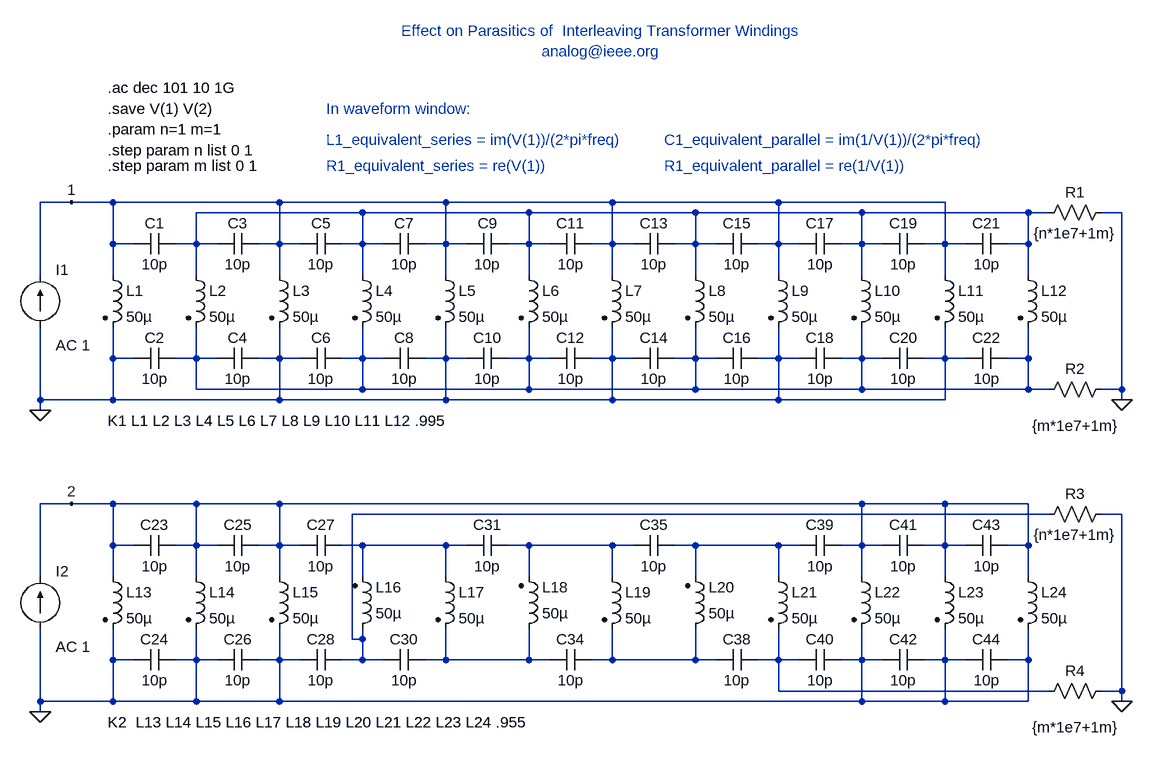
[diagram p0: schematic Transformer_1.asc]
Transformer_1.asc, the LTspice schematic file:
Version 4
SHEET 1 2480 976
WIRE 384 256 384 208
WIRE 384 208 416 208
WIRE 480 208 512 208
WIRE 512 256 512 208
WIRE 512 208 544 208
WIRE 384 336 384 384
WIRE 384 384 416 384
WIRE 480 384 512 384
WIRE 512 336 512 384
WIRE 512 384 544 384
WIRE 608 208 640 208
WIRE 640 208 640 256
WIRE 608 384 640 384
WIRE 640 384 640 336
WIRE 640 208 672 208
WIRE 736 208 768 208
WIRE 864 208 896 208
WIRE 992 208 1024 208
WIRE 1024 208 1024 256
WIRE 640 384 672 384
WIRE 736 384 768 384
WIRE 864 384 896 384
WIRE 992 384 1024 384
WIRE 1024 384 1024 336
WIRE 896 208 896 256
WIRE 896 336 896 384
WIRE 896 208 928 208
WIRE 896 384 928 384
WIRE 768 208 768 256
WIRE 768 336 768 384
WIRE 768 208 800 208
WIRE 768 384 800 384
WIRE 272 256 272 144
WIRE 272 336 272 448
WIRE 272 144 320 144
WIRE 640 144 640 208
WIRE 384 208 384 144
WIRE 384 144 640 144
WIRE 640 144 896 144
WIRE 896 144 896 208
WIRE 272 448 384 448
WIRE 384 448 384 384
WIRE 384 448 640 448
WIRE 640 448 640 384
WIRE 640 448 896 448
WIRE 896 448 896 384
WIRE 272 464 272 448
WIRE 512 208 512 160
WIRE 512 160 768 160
WIRE 768 160 768 208
WIRE 768 160 1024 160
WIRE 1024 160 1024 208
WIRE 512 384 512 432
WIRE 512 432 768 432
WIRE 768 432 768 384
WIRE 768 432 1024 432
WIRE 1024 432 1024 384
WIRE 320 144 384 144
WIRE 1024 160 1280 160
WIRE 1936 160 1936 432
WIRE 1936 432 1904 432
WIRE 1904 160 1936 160
WIRE 1280 432 1024 432
WIRE 1936 448 1936 432
WIRE 1120 208 1152 208
WIRE 1248 208 1280 208
WIRE 1280 208 1280 256
WIRE 1120 384 1152 384
WIRE 1248 384 1280 384
WIRE 1280 384 1280 336
WIRE 1152 208 1152 256
WIRE 1152 336 1152 384
WIRE 1152 208 1184 208
WIRE 1152 384 1184 384
WIRE 1152 144 1152 208
WIRE 1152 448 1152 384
WIRE 1280 160 1280 208
WIRE 1280 432 1280 384
WIRE 1280 160 1536 160
WIRE 1536 432 1280 432
WIRE 1056 208 1024 208
WIRE 1056 384 1024 384
WIRE 896 448 1152 448
WIRE 896 144 1152 144
WIRE 272 720 272 608
WIRE 272 800 272 912
WIRE 272 608 320 608
WIRE 272 912 384 912
WIRE 272 928 272 912
WIRE 320 608 384 608
WIRE 1376 208 1408 208
WIRE 1504 208 1536 208
WIRE 1536 208 1536 256
WIRE 1376 384 1408 384
WIRE 1504 384 1536 384
WIRE 1536 384 1536 336
WIRE 1408 208 1408 256
WIRE 1408 336 1408 384
WIRE 1408 208 1440 208
WIRE 1408 384 1440 384
WIRE 1408 144 1408 208
WIRE 1408 448 1408 384
WIRE 1536 160 1536 208
WIRE 1536 432 1536 384
WIRE 1536 160 1792 160
WIRE 1792 432 1536 432
WIRE 1632 208 1664 208
WIRE 1760 208 1792 208
WIRE 1792 208 1792 256
WIRE 1632 384 1664 384
WIRE 1760 384 1792 384
WIRE 1792 384 1792 336
WIRE 1664 208 1664 256
WIRE 1664 336 1664 384
WIRE 1664 208 1696 208
WIRE 1664 384 1696 384
WIRE 1664 144 1664 208
WIRE 1664 448 1664 384
WIRE 1792 160 1792 208
WIRE 1792 432 1792 384
WIRE 1792 160 1824 160
WIRE 1824 432 1792 432
WIRE 1568 208 1536 208
WIRE 1568 384 1536 384
WIRE 1408 448 1664 448
WIRE 1408 144 1664 144
WIRE 384 720 384 672
WIRE 384 672 416 672
WIRE 480 672 512 672
WIRE 512 720 512 672
WIRE 512 672 544 672
WIRE 384 800 384 848
WIRE 384 848 416 848
WIRE 480 848 512 848
WIRE 512 800 512 848
WIRE 512 848 544 848
WIRE 608 672 640 672
WIRE 640 672 640 720
WIRE 608 848 640 848
WIRE 640 848 640 800
WIRE 640 672 672 672
WIRE 736 672 768 672
WIRE 768 672 896 672
WIRE 992 672 1024 672
WIRE 1024 672 1024 720
WIRE 640 848 672 848
WIRE 736 848 768 848
WIRE 864 848 896 848
WIRE 896 848 1024 848
WIRE 1024 848 1024 800
WIRE 896 672 896 720
WIRE 896 800 896 848
WIRE 896 672 928 672
WIRE 768 672 768 720
WIRE 768 800 768 816
WIRE 768 848 800 848
WIRE 640 608 640 672
WIRE 384 672 384 608
WIRE 384 608 512 608
WIRE 640 608 1536 608
WIRE 384 912 384 848
WIRE 384 912 512 912
WIRE 640 912 640 848
WIRE 512 672 512 608
WIRE 512 848 512 912
WIRE 1936 624 1936 896
WIRE 1936 896 1904 896
WIRE 1904 624 1936 624
WIRE 1936 912 1936 896
WIRE 1024 672 1152 672
WIRE 1248 672 1280 672
WIRE 1280 672 1280 720
WIRE 1120 848 1152 848
WIRE 1152 848 1280 848
WIRE 1280 848 1280 800
WIRE 1152 672 1152 720
WIRE 1152 800 1152 848
WIRE 1152 672 1184 672
WIRE 1056 848 1024 848
WIRE 640 912 1536 912
WIRE 1280 672 1408 672
WIRE 1504 672 1536 672
WIRE 1536 672 1536 720
WIRE 1376 848 1408 848
WIRE 1504 848 1536 848
WIRE 1536 848 1536 800
WIRE 1408 672 1408 720
WIRE 1408 800 1408 848
WIRE 1408 672 1440 672
WIRE 1408 848 1440 848
WIRE 1536 608 1536 672
WIRE 1632 672 1664 672
WIRE 1760 672 1792 672
WIRE 1792 672 1792 720
WIRE 1632 848 1664 848
WIRE 1760 848 1792 848
WIRE 1792 848 1792 800
WIRE 1664 672 1664 720
WIRE 1664 800 1664 848
WIRE 1664 672 1696 672
WIRE 1664 848 1696 848
WIRE 1664 608 1664 672
WIRE 1664 912 1664 848
WIRE 1568 672 1536 672
WIRE 1568 848 1536 848
WIRE 1152 448 1408 448
WIRE 1152 144 1408 144
WIRE 1312 848 1280 848
WIRE 1792 672 1792 608
WIRE 1792 608 1664 608
WIRE 1536 608 1664 608
WIRE 1792 848 1792 912
WIRE 1792 912 1664 912
WIRE 1536 848 1536 912
WIRE 1536 912 1664 912
WIRE 512 912 640 912
WIRE 512 608 640 608
WIRE 1824 896 1408 896
WIRE 1408 896 1408 848
WIRE 768 816 752 816
WIRE 768 816 768 848
WIRE 752 816 752 624
WIRE 752 624 1824 624
WIRE 1312 208 1280 208
WIRE 1312 384 1280 384
FLAG 272 464 0
FLAG 320 144 1
FLAG 1936 448 0
FLAG 272 928 0
FLAG 320 608 2
FLAG 1936 912 0
SYMBOL ind2 368 240 R0
SYMATTR InstName L1
SYMATTR Value 50µ
SYMATTR SpiceLine Rser=.5 Rpar=1e7 Cpar=1p
SYMBOL ind2 496 240 R0
SYMATTR InstName L2
SYMATTR Value 50µ
SYMATTR SpiceLine Rser=.5 Rpar=1e7 Cpar=1p
SYMBOL ind2 624 240 R0
SYMATTR InstName L3
SYMATTR Value 50µ
SYMATTR SpiceLine Rser=.5 Rpar=1e7 Cpar=1p
SYMBOL ind2 752 240 R0
SYMATTR InstName L4
SYMATTR Value 50µ
SYMATTR SpiceLine Rser=.5 Rpar=1e7 Cpar=1p
SYMBOL ind2 880 240 R0
SYMATTR InstName L5
SYMATTR Value 50µ
SYMATTR SpiceLine Rser=.5 Rpar=1e7 Cpar=1p
SYMBOL ind2 1008 240 R0
SYMATTR InstName L6
SYMATTR Value 50µ
SYMATTR SpiceLine Rser=.5 Rpar=1e7 Cpar=1p
SYMBOL cap 480 192 R90
WINDOW 0 0 32 VBottom 0
WINDOW 3 32 32 VTop 0
SYMATTR InstName C1
SYMATTR Value 10p
SYMBOL cap 480 368 R90
WINDOW 0 0 32 VBottom 0
WINDOW 3 32 32 VTop 0
SYMATTR InstName C2
SYMATTR Value 10p
SYMBOL cap 608 192 R90
WINDOW 0 0 32 VBottom 0
WINDOW 3 32 32 VTop 0
SYMATTR InstName C3
SYMATTR Value 10p
SYMBOL cap 608 368 R90
WINDOW 0 0 32 VBottom 0
WINDOW 3 32 32 VTop 0
SYMATTR InstName C4
SYMATTR Value 10p
SYMBOL cap 736 192 R90
WINDOW 0 0 32 VBottom 0
WINDOW 3 32 32 VTop 0
SYMATTR InstName C5
SYMATTR Value 10p
SYMBOL cap 736 368 R90
WINDOW 0 0 32 VBottom 0
WINDOW 3 32 32 VTop 0
SYMATTR InstName C6
SYMATTR Value 10p
SYMBOL cap 864 192 R90
WINDOW 0 0 32 VBottom 0
WINDOW 3 32 32 VTop 0
SYMATTR InstName C7
SYMATTR Value 10p
SYMBOL cap 864 368 R90
WINDOW 0 0 32 VBottom 0
WINDOW 3 32 32 VTop 0
SYMATTR InstName C8
SYMATTR Value 10p
SYMBOL cap 992 192 R90
WINDOW 0 0 32 VBottom 0
WINDOW 3 32 32 VTop 0
SYMATTR InstName C9
SYMATTR Value 10p
SYMBOL cap 992 368 R90
WINDOW 0 0 32 VBottom 0
WINDOW 3 32 32 VTop 0
SYMATTR InstName C10
SYMATTR Value 10p
SYMBOL current 272 336 M180
WINDOW 0 24 88 Left 0
WINDOW 3 24 0 Left 0
WINDOW 123 24 -28 Left 0
WINDOW 39 0 0 Left 0
SYMATTR InstName I1
SYMATTR Value ""
SYMATTR Value2 AC 1
SYMBOL res 1920 144 R90
WINDOW 0 0 56 VBottom 0
WINDOW 3 32 56 VTop 0
SYMATTR InstName R1
SYMATTR Value {n*1e7+1m}
SYMBOL res 1920 416 R90
WINDOW 0 0 56 VBottom 0
WINDOW 3 56 55 VTop 0
SYMATTR InstName R2
SYMATTR Value {m*1e7+1m}
SYMBOL ind2 1136 240 R0
SYMATTR InstName L7
SYMATTR Value 50µ
SYMATTR SpiceLine Rser=.5 Rpar=1e7 Cpar=1p
SYMBOL ind2 1264 240 R0
SYMATTR InstName L8
SYMATTR Value 50µ
SYMATTR SpiceLine Rser=.5 Rpar=1e7 Cpar=1p
SYMBOL cap 1120 192 R90
WINDOW 0 0 32 VBottom 0
WINDOW 3 32 32 VTop 0
SYMATTR InstName C11
SYMATTR Value 10p
SYMBOL cap 1120 368 R90
WINDOW 0 0 32 VBottom 0
WINDOW 3 32 32 VTop 0
SYMATTR InstName C12
SYMATTR Value 10p
SYMBOL cap 1248 192 R90
WINDOW 0 0 32 VBottom 0
WINDOW 3 32 32 VTop 0
SYMATTR InstName C13
SYMATTR Value 10p
SYMBOL cap 1248 368 R90
WINDOW 0 0 32 VBottom 0
WINDOW 3 32 32 VTop 0
SYMATTR InstName C14
SYMATTR Value 10p
SYMBOL current 272 800 M180
WINDOW 0 24 88 Left 0
WINDOW 3 24 0 Left 0
WINDOW 123 24 -28 Left 0
WINDOW 39 0 0 Left 0
SYMATTR InstName I2
SYMATTR Value ""
SYMATTR Value2 AC 1
SYMBOL ind2 1392 240 R0
SYMATTR InstName L9
SYMATTR Value 50µ
SYMATTR SpiceLine Rser=.5 Rpar=1e7 Cpar=1p
SYMBOL ind2 1520 240 R0
SYMATTR InstName L10
SYMATTR Value 50µ
SYMATTR SpiceLine Rser=.5 Rpar=1e7 Cpar=1p
SYMBOL cap 1376 192 R90
WINDOW 0 0 32 VBottom 0
WINDOW 3 32 32 VTop 0
SYMATTR InstName C15
SYMATTR Value 10p
SYMBOL cap 1376 368 R90
WINDOW 0 0 32 VBottom 0
WINDOW 3 32 32 VTop 0
SYMATTR InstName C16
SYMATTR Value 10p
SYMBOL cap 1504 192 R90
WINDOW 0 0 32 VBottom 0
WINDOW 3 32 32 VTop 0
SYMATTR InstName C17
SYMATTR Value 10p
SYMBOL cap 1504 368 R90
WINDOW 0 0 32 VBottom 0
WINDOW 3 32 32 VTop 0
SYMATTR InstName C18
SYMATTR Value 10p
SYMBOL ind2 1648 240 R0
SYMATTR InstName L11
SYMATTR Value 50µ
SYMATTR SpiceLine Rser=.5 Rpar=1e7 Cpar=1p
SYMBOL ind2 1776 240 R0
SYMATTR InstName L12
SYMATTR Value 50µ
SYMATTR SpiceLine Rser=.5 Rpar=1e7 Cpar=1p
SYMBOL cap 1632 192 R90
WINDOW 0 0 32 VBottom 0
WINDOW 3 32 32 VTop 0
SYMATTR InstName C19
SYMATTR Value 10p
SYMBOL cap 1632 368 R90
WINDOW 0 0 32 VBottom 0
WINDOW 3 32 32 VTop 0
SYMATTR InstName C20
SYMATTR Value 10p
SYMBOL cap 1760 192 R90
WINDOW 0 0 32 VBottom 0
WINDOW 3 32 32 VTop 0
SYMATTR InstName C21
SYMATTR Value 10p
SYMBOL cap 1760 368 R90
WINDOW 0 0 32 VBottom 0
WINDOW 3 32 32 VTop 0
SYMATTR InstName C22
SYMATTR Value 10p
SYMBOL ind2 368 704 R0
SYMATTR InstName L13
SYMATTR Value 50µ
SYMATTR SpiceLine Rser=.5 Rpar=1e7 Cpar=1p
SYMBOL ind2 496 704 R0
SYMATTR InstName L14
SYMATTR Value 50µ
SYMATTR SpiceLine Rser=.5 Rpar=1e7 Cpar=1p
SYMBOL ind2 624 704 R0
SYMATTR InstName L15
SYMATTR Value 50µ
SYMATTR SpiceLine Rser=.5 Rpar=1e7 Cpar=1p
SYMBOL ind2 752 816 M180
WINDOW 0 36 80 Left 0
WINDOW 3 36 40 Left 0
SYMATTR InstName L16
SYMATTR Value 50µ
SYMATTR SpiceLine Rser=.5 Rpar=1e7 Cpar=1p
SYMBOL ind2 880 704 R0
SYMATTR InstName L17
SYMATTR Value 50µ
SYMATTR SpiceLine Rser=.5 Rpar=1e7 Cpar=1p
SYMBOL ind2 1008 816 M180
WINDOW 0 36 80 Left 0
WINDOW 3 36 40 Left 0
SYMATTR InstName L18
SYMATTR Value 50µ
SYMATTR SpiceLine Rser=.5 Rpar=1e7 Cpar=1p
SYMBOL cap 480 656 R90
WINDOW 0 0 32 VBottom 0
WINDOW 3 32 32 VTop 0
SYMATTR InstName C23
SYMATTR Value 10p
SYMBOL cap 480 832 R90
WINDOW 0 0 32 VBottom 0
WINDOW 3 32 32 VTop 0
SYMATTR InstName C24
SYMATTR Value 10p
SYMBOL cap 608 656 R90
WINDOW 0 0 32 VBottom 0
WINDOW 3 32 32 VTop 0
SYMATTR InstName C25
SYMATTR Value 10p
SYMBOL cap 608 832 R90
WINDOW 0 0 32 VBottom 0
WINDOW 3 32 32 VTop 0
SYMATTR InstName C26
SYMATTR Value 10p
SYMBOL cap 736 656 R90
WINDOW 0 0 32 VBottom 0
WINDOW 3 32 32 VTop 0
SYMATTR InstName C27
SYMATTR Value 10p
SYMBOL cap 736 832 R90
WINDOW 0 0 32 VBottom 0
WINDOW 3 32 32 VTop 0
SYMATTR InstName C28
SYMATTR Value 10p
SYMBOL cap 864 832 R90
WINDOW 0 0 32 VBottom 0
WINDOW 3 32 32 VTop 0
SYMATTR InstName C30
SYMATTR Value 10p
SYMBOL cap 992 656 R90
WINDOW 0 0 32 VBottom 0
WINDOW 3 32 32 VTop 0
SYMATTR InstName C31
SYMATTR Value 10p
SYMBOL res 1920 608 R90
WINDOW 0 0 56 VBottom 0
WINDOW 3 32 56 VTop 0
SYMATTR InstName R3
SYMATTR Value {n*1e7+1m}
SYMBOL res 1920 880 R90
WINDOW 0 0 56 VBottom 0
WINDOW 3 56 55 VTop 0
SYMATTR InstName R4
SYMATTR Value {m*1e7+1m}
SYMBOL ind2 1136 704 R0
SYMATTR InstName L19
SYMATTR Value 50µ
SYMATTR SpiceLine Rser=.5 Rpar=1e7 Cpar=1p
SYMBOL ind2 1264 816 M180
WINDOW 0 36 80 Left 0
WINDOW 3 36 40 Left 0
SYMATTR InstName L20
SYMATTR Value 50µ
SYMATTR SpiceLine Rser=.5 Rpar=1e7 Cpar=1p
SYMBOL cap 1120 832 R90
WINDOW 0 0 32 VBottom 0
WINDOW 3 32 32 VTop 0
SYMATTR InstName C34
SYMATTR Value 10p
SYMBOL cap 1248 656 R90
WINDOW 0 0 32 VBottom 0
WINDOW 3 32 32 VTop 0
SYMATTR InstName C35
SYMATTR Value 10p
SYMBOL ind2 1392 704 R0
SYMATTR InstName L21
SYMATTR Value 50µ
SYMATTR SpiceLine Rser=.5 Rpar=1e7 Cpar=1p
SYMBOL ind2 1520 704 R0
SYMATTR InstName L22
SYMATTR Value 50µ
SYMATTR SpiceLine Rser=.5 Rpar=1e7 Cpar=1p
SYMBOL cap 1376 832 R90
WINDOW 0 0 32 VBottom 0
WINDOW 3 32 32 VTop 0
SYMATTR InstName C38
SYMATTR Value 10p
SYMBOL cap 1504 656 R90
WINDOW 0 0 32 VBottom 0
WINDOW 3 32 32 VTop 0
SYMATTR InstName C39
SYMATTR Value 10p
SYMBOL cap 1504 832 R90
WINDOW 0 0 32 VBottom 0
WINDOW 3 32 32 VTop 0
SYMATTR InstName C40
SYMATTR Value 10p
SYMBOL ind2 1648 704 R0
SYMATTR InstName L23
SYMATTR Value 50µ
SYMATTR SpiceLine Rser=.5 Rpar=1e7 Cpar=1p
SYMBOL ind2 1776 704 R0
SYMATTR InstName L24
SYMATTR Value 50µ
SYMATTR SpiceLine Rser=.5 Rpar=1e7 Cpar=1p
SYMBOL cap 1632 656 R90
WINDOW 0 0 32 VBottom 0
WINDOW 3 32 32 VTop 0
SYMATTR InstName C41
SYMATTR Value 10p
SYMBOL cap 1632 832 R90
WINDOW 0 0 32 VBottom 0
WINDOW 3 32 32 VTop 0
SYMATTR InstName C42
SYMATTR Value 10p
SYMBOL cap 1760 656 R90
WINDOW 0 0 32 VBottom 0
WINDOW 3 32 32 VTop 0
SYMATTR InstName C43
SYMATTR Value 10p
SYMBOL cap 1760 832 R90
WINDOW 0 0 32 VBottom 0
WINDOW 3 32 32 VTop 0
SYMATTR InstName C44
SYMATTR Value 10p
TEXT 376 480 Left 0 !K1 L1 L2 L3 L4 L5 L6 L7 L8 L9 L10 L11 L12 .995
TEXT 376 -32 Left 0 !.ac dec 101 10 1G
TEXT 376 32 Left 0 !.param n=1 m=1
TEXT 376 64 Left 0 !.step param n list 0 1
TEXT 712 48 Left 0 ;L1_equivalent_series = im(V(1))/(2*pi*freq)
TEXT 376 88 Left 0 !.step param m list 0 1
TEXT 376 0 Left 0 !.save V(1) V(2)
TEXT 376 944 Left 0 !K2  L13 L14 L15 L16 L17 L18 L19 L20 L21 L22 L23 L24 .955
TEXT 712 88 Left 0 ;R1_equivalent_series = re(V(1))
TEXT 1232 48 Left 0 ;C1_equivalent_parallel = im(1/V(1))/(2*pi*freq)
TEXT 1232 88 Left 0 ;R1_equivalent_parallel = re(1/V(1))
TEXT 1136 -104 Center 0 ;Effect on Parasitics of  Interleaving Transformer Windings\nanalog@ieee.org
TEXT 712 0 Left 0 ;In waveform window:

The netlist it stands for:
* Transformer_1.asc
L1 1 0 50µ Rser=.5 Rpar=1e7 Cpar=1p
L2 N001 N002 50µ Rser=.5 Rpar=1e7 Cpar=1p
L3 1 0 50µ Rser=.5 Rpar=1e7 Cpar=1p
L4 N001 N002 50µ Rser=.5 Rpar=1e7 Cpar=1p
L5 1 0 50µ Rser=.5 Rpar=1e7 Cpar=1p
L6 N001 N002 50µ Rser=.5 Rpar=1e7 Cpar=1p
C1 N001 1 10p
C2 N002 0 10p
C3 1 N001 10p
C4 0 N002 10p
C5 N001 1 10p
C6 N002 0 10p
C7 1 N001 10p
C8 0 N002 10p
C9 N001 1 10p
C10 N002 0 10p
I1 0 1 AC 1
R1 0 N001 {n*1e7+1m}
R2 0 N002 {m*1e7+1m}
L7 1 0 50µ Rser=.5 Rpar=1e7 Cpar=1p
L8 N001 N002 50µ Rser=.5 Rpar=1e7 Cpar=1p
C11 1 N001 10p
C12 0 N002 10p
C13 N001 1 10p
C14 N002 0 10p
I2 0 2 AC 1
L9 1 0 50µ Rser=.5 Rpar=1e7 Cpar=1p
L10 N001 N002 50µ Rser=.5 Rpar=1e7 Cpar=1p
C15 1 N001 10p
C16 0 N002 10p
C17 N001 1 10p
C18 N002 0 10p
L11 1 0 50µ Rser=.5 Rpar=1e7 Cpar=1p
L12 N001 N002 50µ Rser=.5 Rpar=1e7 Cpar=1p
C19 1 N001 10p
C20 0 N002 10p
C21 N001 1 10p
C22 N002 0 10p
L13 2 0 50µ Rser=.5 Rpar=1e7 Cpar=1p
L14 2 0 50µ Rser=.5 Rpar=1e7 Cpar=1p
L15 2 0 50µ Rser=.5 Rpar=1e7 Cpar=1p
L16 N005 N003 50µ Rser=.5 Rpar=1e7 Cpar=1p
L17 N003 N006 50µ Rser=.5 Rpar=1e7 Cpar=1p
L18 N006 N004 50µ Rser=.5 Rpar=1e7 Cpar=1p
C23 2 2 10p
C24 0 0 10p
C25 2 2 10p
C26 0 0 10p
C27 N003 2 10p
C28 N005 0 10p
C30 N006 N005 10p
C31 N004 N003 10p
R3 0 N005 {n*1e7+1m}
R4 0 N009 {m*1e7+1m}
L19 N004 N008 50µ Rser=.5 Rpar=1e7 Cpar=1p
L20 N008 N007 50µ Rser=.5 Rpar=1e7 Cpar=1p
C34 N008 N006 10p
C35 N007 N004 10p
L21 N007 N009 50µ Rser=.5 Rpar=1e7 Cpar=1p
L22 2 0 50µ Rser=.5 Rpar=1e7 Cpar=1p
C38 N009 N008 10p
C39 2 N007 10p
C40 0 N009 10p
L23 2 0 50µ Rser=.5 Rpar=1e7 Cpar=1p
L24 2 0 50µ Rser=.5 Rpar=1e7 Cpar=1p
C41 2 2 10p
C42 0 0 10p
C43 2 2 10p
C44 0 0 10p
K1 L1 L2 L3 L4 L5 L6 L7 L8 L9 L10 L11 L12 .995
.ac dec 101 10 1G
.param n=1 m=1
.step param n list 0 1
* L1_equivalent_series = im(V(1))/(2*pi*freq)
.step param m list 0 1
.save V(1) V(2)
K2  L13 L14 L15 L16 L17 L18 L19 L20 L21 L22 L23 L24 .955
* R1_equivalent_series = re(V(1))
* C1_equivalent_parallel = im(1/V(1))/(2*pi*freq)
* R1_equivalent_parallel = re(1/V(1))
* Effect on Parasitics of  Interleaving Transformer Windings
* analog@ieee.org
* In waveform window:
.backanno
.end